# Altium schematic sheet BoardB-USB.SchDoc
size A; SheetNumber: 6; SheetTotal: 9
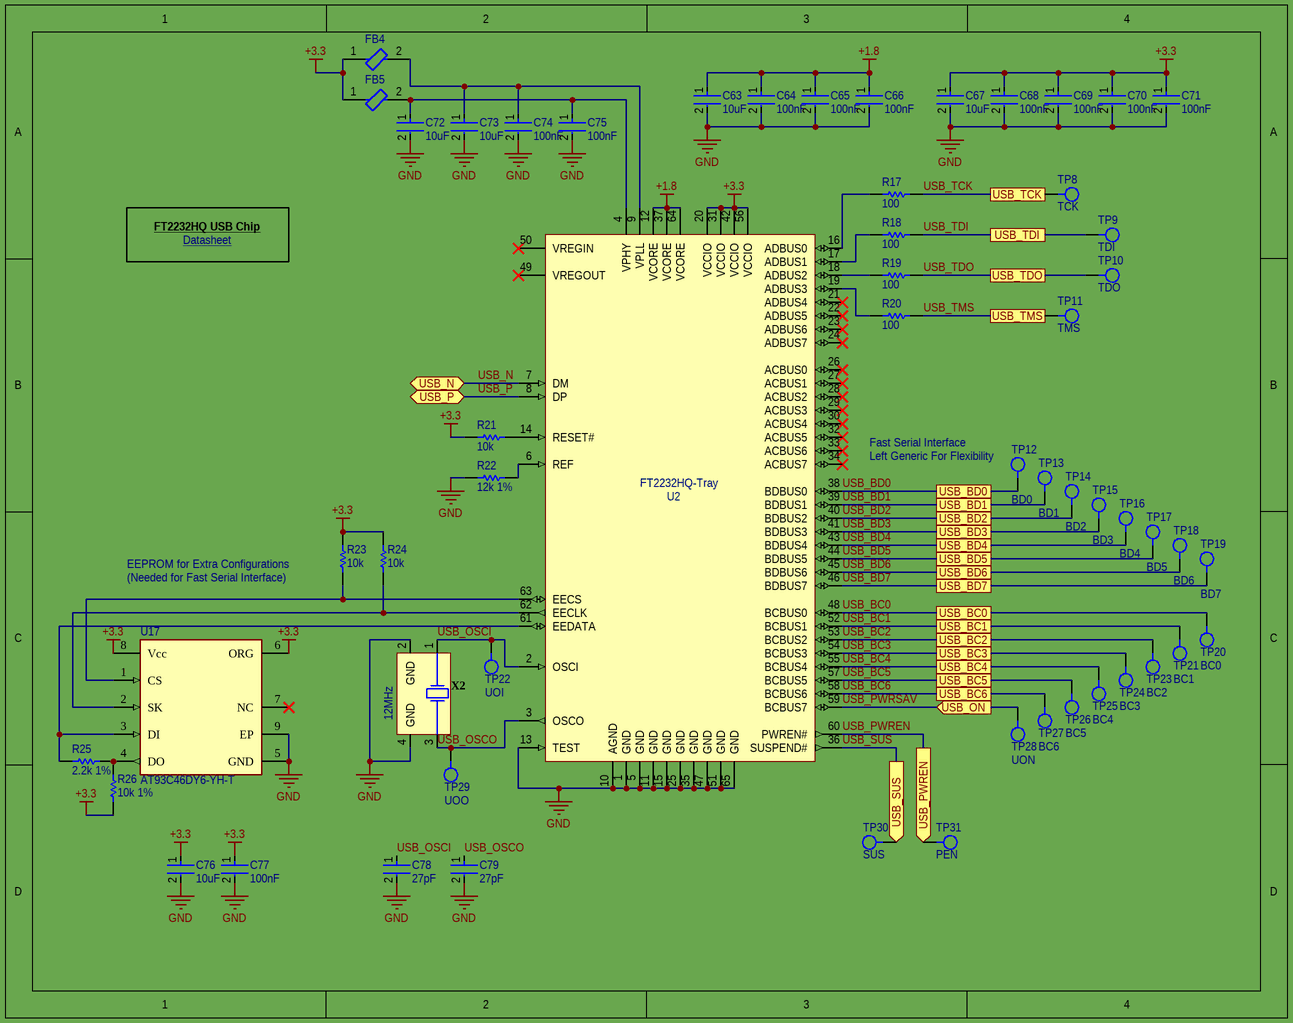
[diagram p0: BoardB-USB.SchDoc]

## Parts
C63  10uF  [FP-GRM188-0_1-e0_2_0_55-IPC_A]
C64  100nF  [FP-CGA3E-0_3-0_1-IPC_A]
C65  100nF  [FP-CGA3E-0_3-0_1-IPC_A]
C66  100nF  [FP-CGA3E-0_3-0_1-IPC_A]
C67  10uF  [FP-GRM188-0_1-e0_2_0_55-IPC_A]
C68  100nF  [FP-CGA3E-0_3-0_1-IPC_A]
C69  100nF  [FP-CGA3E-0_3-0_1-IPC_A]
C70  100nF  [FP-CGA3E-0_3-0_1-IPC_A]
C71  100nF  [FP-CGA3E-0_3-0_1-IPC_A]
C72  10uF  [FP-GRM188-0_1-e0_2_0_55-IPC_A]
C73  10uF  [FP-GRM188-0_1-e0_2_0_55-IPC_A]
C74  100nF  [FP-CGA3E-0_3-0_1-IPC_A]
C75  100nF  [FP-CGA3E-0_3-0_1-IPC_A]
C76  10uF  [FP-GRM188-0_1-e0_2_0_55-IPC_A]
C77  100nF  [FP-CGA3E-0_3-0_1-IPC_A]
C78  27pF  [FP-C0402-BB-MFG]
C79  27pF  [FP-C0402-BB-MFG]
FB4  BLM18AG601SN1D  [FP-BLM18-0_15-t0_8-MFG]  (value not drawn)
FB5  BLM18AG601SN1D  [FP-BLM18-0_15-t0_8-MFG]  (value not drawn)
R17  100  [RESC1005X40X25ML05T10]
R18  100  [RESC1005X40X25ML05T10]
R19  100  [RESC1005X40X25ML05T10]
R20  100  [RESC1005X40X25ML05T10]
R21  10k  [RESC1005X40X25LL05T05]
R22  12k 1%  [RESC1005X40X25ML05T05]
R23  10k  [RESC1005X40X25LL05T05]
R24  10k  [RESC1005X40X25LL05T05]
R25  2.2k 1%  [RESC1005X40X25NL05T10]
R26  10k 1%  [RESC1005X40X25LL05T05]
TP8  TCK  [TestPoint1mm]
TP9  TDI  [TestPoint1mm]
TP10  TDO  [TestPoint1mm]
TP11  TMS  [TestPoint1mm]
TP12  BD0  [TestPoint1mm]
TP13  BD1  [TestPoint1mm]
TP14  BD2  [TestPoint1mm]
TP15  BD3  [TestPoint1mm]
TP16  BD4  [TestPoint1mm]
TP17  BD5  [TestPoint1mm]
TP18  BD6  [TestPoint1mm]
TP19  BD7  [TestPoint1mm]
TP20  BC0  [TestPoint1mm]
TP21  BC1  [TestPoint1mm]
TP22  UOI  [TestPoint1mm]
TP23  BC2  [TestPoint1mm]
TP24  BC3  [TestPoint1mm]
TP25  BC4  [TestPoint1mm]
TP26  BC5  [TestPoint1mm]
TP27  BC6  [TestPoint1mm]
TP28  UON  [TestPoint1mm]
TP29  UOO  [TestPoint1mm]
TP30  SUS  [TestPoint1mm]
TP31  PEN  [TestPoint1mm]
U2  FT2232HQ-Tray  [QFN64_2_N]
U17  AT93C46DY6-YH-T  [FP-C04-21355-Q4B-IPC_C]
X2  ABM8G-12.000MHZ-4Y-T3  [ABM8G-12.000MHZ-4Y-T3]  (value not drawn)

## Ports
USB_BC0, USB_BC1, USB_BC2, USB_BC3, USB_BC4, USB_BC5, USB_BC6, USB_BD0, USB_BD1, USB_BD2, USB_BD3, USB_BD4, USB_BD5, USB_BD6, USB_BD7, USB_N (bidir), USB_ON (in), USB_P (bidir), USB_PWREN (out), USB_SUS (out), USB_TCK, USB_TDI, USB_TDO, USB_TMS

## Nets
+1.8: C63.1 C64.1 C65.1 C66.1 U2.12(VCORE) U2.37(VCORE) U2.64(VCORE)
+3.3: C67.1 C68.1 C69.1 C70.1 C71.1 C76.1 C77.1 FB4.1 FB5.1 R21.2 R23.2 R24.2 R26.1 U2.20(VCCIO) U2.31(VCCIO) U2.42(VCCIO) U2.56(VCCIO) U17.6(ORG) U17.8(Vcc)
GND: C63.2 C64.2 C65.2 C66.2 C67.2 C68.2 C69.2 C70.2 C71.2 C72.2 C73.2 C74.2 C75.2 C76.2 C77.2 C78.2 C79.2 R22.1 U2.1(GND) U2.5(GND) U2.10(AGND) U2.11(GND) U2.13(TEST) U2.15(GND) U2.25(GND) U2.35(GND) U2.47(GND) U2.51(GND) U2.65(GND) U17.5(GND) U17.9(EP) X2.2(GND) X2.4(GND)
USB_BC0: TP20.1 U2.48(BCBUS0) ; port USB_BC0
USB_BC1: TP21.1 U2.52(BCBUS1) ; port USB_BC1
USB_BC2: TP23.1 U2.53(BCBUS2) ; port USB_BC2
USB_BC3: TP24.1 U2.54(BCBUS3) ; port USB_BC3
USB_BC4: TP25.1 U2.55(BCBUS4) ; port USB_BC4
USB_BC5: TP26.1 U2.57(BCBUS5) ; port USB_BC5
USB_BC6: TP27.1 U2.58(BCBUS6) ; port USB_BC6
USB_BD0: TP12.1 U2.38(BDBUS0) ; port USB_BD0
USB_BD1: TP13.1 U2.39(BDBUS1) ; port USB_BD1
USB_BD2: TP14.1 U2.40(BDBUS2) ; port USB_BD2
USB_BD3: TP15.1 U2.41(BDBUS3) ; port USB_BD3
USB_BD4: TP16.1 U2.43(BDBUS4) ; port USB_BD4
USB_BD5: TP17.1 U2.44(BDBUS5) ; port USB_BD5
USB_BD6: TP18.1 U2.45(BDBUS6) ; port USB_BD6
USB_BD7: TP19.1 U2.46(BDBUS7) ; port USB_BD7
USB_N: U2.7(DM) ; port USB_N
USB_OSCI: C78.1 TP22.1 U2.2(OSCI) X2.1
USB_OSCO: C79.1 TP29.1 U2.3(OSCO) X2.3
USB_P: U2.8(DP) ; port USB_P
USB_PWREN: TP31.1 U2.60(PWREN#) ; port USB_PWREN
USB_PWRSAV: TP28.1 U2.59(BCBUS7) ; port USB_ON
USB_SUS: TP30.1 U2.36(SUSPEND#) ; port USB_SUS
USB_TCK: R17.2 TP8.1 ; port USB_TCK
USB_TDI: R18.2 TP9.1 ; port USB_TDI
USB_TDO: R19.2 TP10.1 ; port USB_TDO
USB_TMS: R20.2 TP11.1 ; port USB_TMS
NetC72_1: C72.1 C75.1 FB5.2 U2.4(VPHY)
NetC73_1: C73.1 C74.1 FB4.2 U2.9(VPLL)
NetR17_1: R17.1 U2.16(ADBUS0)
NetR18_1: R18.1 U2.17(ADBUS1)
NetR19_1: R19.1 U2.18(ADBUS2)
NetR20_1: R20.1 U2.19(ADBUS3)
NetR21_1: R21.1 U2.14(RESET#)
NetR22_2: R22.2 U2.6(REF)
NetR23_1: R23.1 U2.63(EECS) U17.1(CS)
NetR24_1: R24.1 U2.62(EECLK) U17.2(SK)
NetR25_1: R25.1 U2.61(EEDATA) U17.3(DI)
NetR25_2: R25.2 R26.2 U17.4(DO)

Not connected (* = marked no-connect by the designer): U2 21(ADBUS4)* 22(ADBUS5)* 23(ADBUS6)* 24(ADBUS7)* 26(ACBUS0)* 27(ACBUS1)* 28(ACBUS2)* 29(ACBUS3)* 30(ACBUS4)* 32(ACBUS5)* 33(ACBUS6)* 34(ACBUS7)* 49(VREGOUT)* 50(VREGIN)*; U17 7(NC)*

## Notes on the sheet
- FT2232HQ USB Chip
- Datasheet <https://www.ftdichip.com/Support/Documents/DataSheets/ICs/DS_FT2232H.pdf>
- Fast Serial Interface
- (near TP12) Left Generic For Flexibility
- (near R23) EEPROM for Extra Configurations
- (near R23) (Needed for Fast Serial Interface)
- (near X2) 12MHz

## Library data of the parts
C63 C67 C72 C73 C76 = CMP-2006-02792-2: Chip Multilayer Ceramic Capacitors for General Purpose, 0603, 10uF, X5R, 15%, 20%, 6.3V; Packaging: Tape and Reel; Voltage Rating (DC): 6.3V; Width: 0.031inch; Termination: SMD/SMT; Dielectric: X5R; Package Quantity: 4000; Voltage Rating: 6.3V; Capacitance: 10uF; Case/Package: 0603; Min Operating Temperature: -55°C; Voltage: 6.3V; Length: 1.6mm; Thickness: 0.035inch; Lead Free: Lead Free; Depth: 0.8mm; Case Code (Imperial): 0603; Max Operating Temperature: 85°C; Material: Ceramic; Height: 0.8mm; Tolerance: 20%; Mount: Surface Mount; REACH SVHC: No SVHC; Radiation Hardening: No; Case Code (Metric): 1608
C64-C66 C68-C71 C74 C75 C77 = CMP-2000-07546-2: Cap Ceramic 100nF 50V X7R 10% Pad SMD 0603 +125°C Automotive T/R; Weight: 7.1E-05oz; Composition: Ceramic; Max Operating Temperature: 125°C; Termination: SMD/SMT; Dielectric: X7R; Length: 1.6mm; Package Quantity: 1; REACH SVHC: No SVHC; Lead Free: Lead Free; Case Code (Metric): 1608; Min Operating Temperature: -55°C; Packaging: Tape and Reel; Tolerance: 10%; Voltage Rating: 50V; Case Code (Imperial): 0603; Capacitance: 100nF; Case/Package: 0603; Voltage Rating (DC): 50V; Depth: 0.8mm; Radiation Hardening: No; Ratings: AEC-Q200; Mount: Surface Mount; Voltage: 50V; Thickness: 0.035inch; Width: 0.8mm; Height: 0.8mm
C78 C79 = CMP-1034-00963-6: CAP CER 27PF 50V C0G/NP0 0402; Manufacturer: Kemet; Manufacturer Part Number: C0402C270J5GACTU; Temperature Coefficient: 15%; Tolerance: 0.05; Temperature Characteristic: C0G; Material: Ceramic; Device Class L1: Passive Components; Device Class L3: Ceramic Capacitors; RoHS: TRUE; Height: 0.55mm; Value: 27 pF; Device Class L2: Capacitors; Capacitance: 27 pF; Automotive: No; Octopart: https://octopart.com/c0402c270j5gactu-kemet-149444; Temperature: -55°C to +125°C; Temperature Range Low: -55°C; Package: C0402-BB; Ipc Land Pattern Name: CAPC10050X50; Category: Cap; Lead Free: Yes; Temperature Range High: +125°C; ComponentLink2URL: https://content.kemet.com/datasheets/KEM_C1002_X7R_SMD.pdf; ComponentLink2Description: Datasheet; Mouser Description: Multilayer Ceramic Capacitor, C Series, 27 pF, - 5%, C0G / NP0, 50 V, 0402 [1005 Metric]; Digikey Description: CAP CER 27PF 50V C0G/NP0 0402; Voltage Rating: 50 V
FB4 FB5 = CMP-0686-00436-3: Chip Ferrite Bead, 0603, 600Ω @ 100MHz, 0.38Ω, 25%, 500mA; Number of Lines: 1; Impedance: 600R; DC Resistance (DCR): 380mR; Material: Steel; Shielding: Unshielded; Max DC Current: 500mA; Termination: SMD/SMT; Military Standard: Not; Number of Circuits: 1; Min Operating Temperature: -55°C; Case Code (Imperial): 0603; Width: 0.8mm; Current Rating: 500mA; Lead Free: Lead Free; Packaging: Tape and Reel; Frequency: 100MHz; Max Operating Temperature: 125°C; DC Current: 500mA; REACH SVHC: No SVHC; Case/Package: 0603; Package Quantity: 1; Height: 0.8mm; Number of Pins: 2; Depth: 0.8mm; Test Frequency: 100MHz; Case Code (Metric): 1608; Tolerance: 25%; Core Material: Ferrite; Weight: 7.1E-05oz; Max Current Rating: 500mA; Radiation Hardening: No; Length: 1.6mm; RoHS Compliant: Yes
R17-R20 = CMP-2002-07344-1: Part Number: RC0402FR-07100RL; Manufacturer: Yageo / Phycomp
R21 R23 R24 R26 = CMP-2000-07588-1: Chip Resistor, 10 KOhm, +/- 1%, 0.1 W, -55 to 155 degC, 0402 (1005 Metric), RoHS, Tape and Reel; Manufacturer: Panasonic; Power Rating: 100mW; Voltage Rating: 50V; Resistance: 10KOhm; Case\/Package: 0402; Temperature Coefficient: 100ppm\/degreesC; RoHSCompliant: True; Lead Free: LeadFree; Package Quantity: 1; Contact Plating: Tin; Length: 1mm; Radiation Hardening: No; REACH SVHC: NoSVHC; Max Operating Temperature: 155degC; Depth: 0.5mm; Case Code (Imperial): 0402; Military Standard: Not; Package Description: 2-Pin Surface Mount Device, Body 1 x 0.5 mm; Termination: SMD/SMT; Case Code (Metric): 1005; Height: 0.35mm; Packaging: TapeandReel; Voltage Rating (DC): 50V; Package Reference: 402; Number of Pins: 2; Tolerance: 1%; Mounting Technology: SurfaceMount; Width: 0.02inch; Mount: SurfaceMount; Datasheet URL: https://industrial.panasonic.com/cdbs/www-data/pdf/RDA0000/AOA0000C304.pdf; Composition: ThickFilm; Datasheet Version: 02/2017; Manufacturer URL: http://www.panasonic.com/; Max Power Dissipation: 100mW; Number of Terminations: 2; Min Operating Temperature: -55degC
R22 = CMP-2002-00646-4: Chip Resistor, 12 KOhm, +/- 1%, 0.1 W, -55 to 155 degC, 0402 (1005 Metric), RoHS, Tape and Reel; PartNumber: ERJ-2RKF1202X; Resistance: 12 KOhm; Voltage Rating: 50 V; Case\/Package: 0402; Power Rating: 100 mW; Length: 1 mm; PackageReference: 0402; DatasheetVersion: 04/2015; ComponentLink2Description: Datasheet; ComponentLink1URL: http://www.panasonic.com/; Pins: 2; Width: 0.5 mm; REACH SVHC: Yes; Packaging: Tape and Reel; Min Operating Temperature: -55 degC; Mounting Technology: Surface Mount; Max Operating Temperature: 155 degC; Case Code (Imperial): 0402; Height: 0.35 mm; Tolerance: 1%; PackageDescription: 2-Pin Surface Mount Device, Body 1 x 0.5 mm; RoHSCompliant: true; ComponentLink1Description: Manufacturer URL; Mount: Surface Mount; ComponentLink2URL: http://industrial.panasonic.com/cdbs/www-data/pdf/RDA0000/AOA0000C86.pdf; Package Quantity: 10000; Case Code (Metric): 1005
R25 = CMP-2002-07567-1: Manufacturer: Yageo / Phycomp; Part Number: RC0402FR-072K2L
TP8-TP31 = TestPoint1mm: Test Point 1mm Diameter
U2 = CMP-0078-00003-3: Dual High Speed USB To Multipurpose UART/FIFO IC, 64-pin QFN, Tray; Manufacturer: FTDI; PackageVersion: Jun-12; ComponentLink2URL: http://www.ftdichip.com/Support/Documents/DataSheets/ICs/DS_FT2232H.pdf; ComponentLink1Description: Manufacturer URL; RevisionNote: DatasheetVersion updated to 2.21 Jun-2012; PackageReference: QFN64_2; PackageDescription: 64-Pin Quad Flat No-Lead, 9 x 9 mm Body, 0.5 mm Pitch, 4.35 x 4.35 mm Exposed Pad; ComponentLink2Description: Datasheet; ComponentLink1URL: http://www.ftdichip.com/; PartNumber: FT2232HQ-Tray; DatasheetVersion: ver 2.21, Jun-2012
U17 = CMP-06313-000080-1: IC EEPROM 1KBIT SPI 8MINI MAP; Frequency: 2MHz; Memory Type: Non-Volatile; Memory Size: 1Kb; Max Operating Temperature: 85°C; RoHS Compliant: Yes; Packaging: Tape and Reel; Min Operating Temperature: -40°C; Mount: Surface Mount
X2 = ABM8G-12.000MHZ-4Y-T3: ABRACON - ABM8G-12.000MHZ-4Y-T3 - CRYSTAL, 12MHZ, 10PF, 3.2 X 2.5MM; ESR (Equivalent Series Resistance): 120R; Frequency Tolerance: 30ppm; Supplier 1: Digi-Key; RoHS: Yes; Stock 1: 11481; Pricing 1: 1=0.67000, 10=0.59600, 50=0.55720, 100=0.49250, 500=0.46656, 1000=0.38880 (USD); Mount: Surface Mount; Case/Package: CSMD; Number of Pins: 4; Min Operating Temperature: -10°C; Max Operating Temperature: 60°C; Frequency: 12MHz; Load Capacitance: 10pF; Packaging: Tape and Reel; Frequency Stability: 30ppm; Series: ABM8G; Series Resistance: 120R; Operating Frequency: 12 MHz; Length: 3.2mm; Width: 0.098inch; Height: 0.039inch; Depth: 2.5mm; REACH SVHC: No SVHC; Lead Free: Lead Free; ComponentLink1URL: https://datasheet.ciiva.com/15116/getdatasheetpartid-719872-15116768.pdf?src-supplier=Verical; ComponentLink1Description: https://datasheet.ciiva.com/15116/getdatasheetpartid-719872-15116768.pdf?src-supplier=Verical; ComponentLink2URL: https://datasheet.ciiva.com/857/abm8g-857959.pdf?src-supplier=Digi-Key; ComponentLink2Description: https://datasheet.ciiva.com/857/abm8g-857959.pdf?src-supplier=Digi-Key; ComponentLink3URL: https://datasheet.ciiva.com/857/abm8g-857960.pdf?src-supplier=Digi-Key; ComponentLink3Description: https://datasheet.ciiva.com/857/abm8g-857960.pdf?src-supplier=Digi-Key; ComponentLink4URL: https://datasheet.ciiva.com/857/abm8g-857961.pdf?src-supplier=Digi-Key; ComponentLink4Description: https://datasheet.ciiva.com/857/abm8g-857961.pdf?src-supplier=Digi-Key; ComponentLink5URL: https://datasheet.ciiva.com/16216/abm8g-16216655.pdf?src-supplier=Future+Electronics; ComponentLink5Description: https://datasheet.ciiva.com/16216/abm8g-16216655.pdf?src-supplier=Future+Electronics; Manufacturer Part Number: ABM8G-12.000MHZ-4Y-T3; Manufacturer: Abracon; Supplier Part Number 1: 535-10901-1-ND; Category: Crystals